# EAGLE design IQInput (EAGLE 9.3.1)

## Sheet 1 of 2
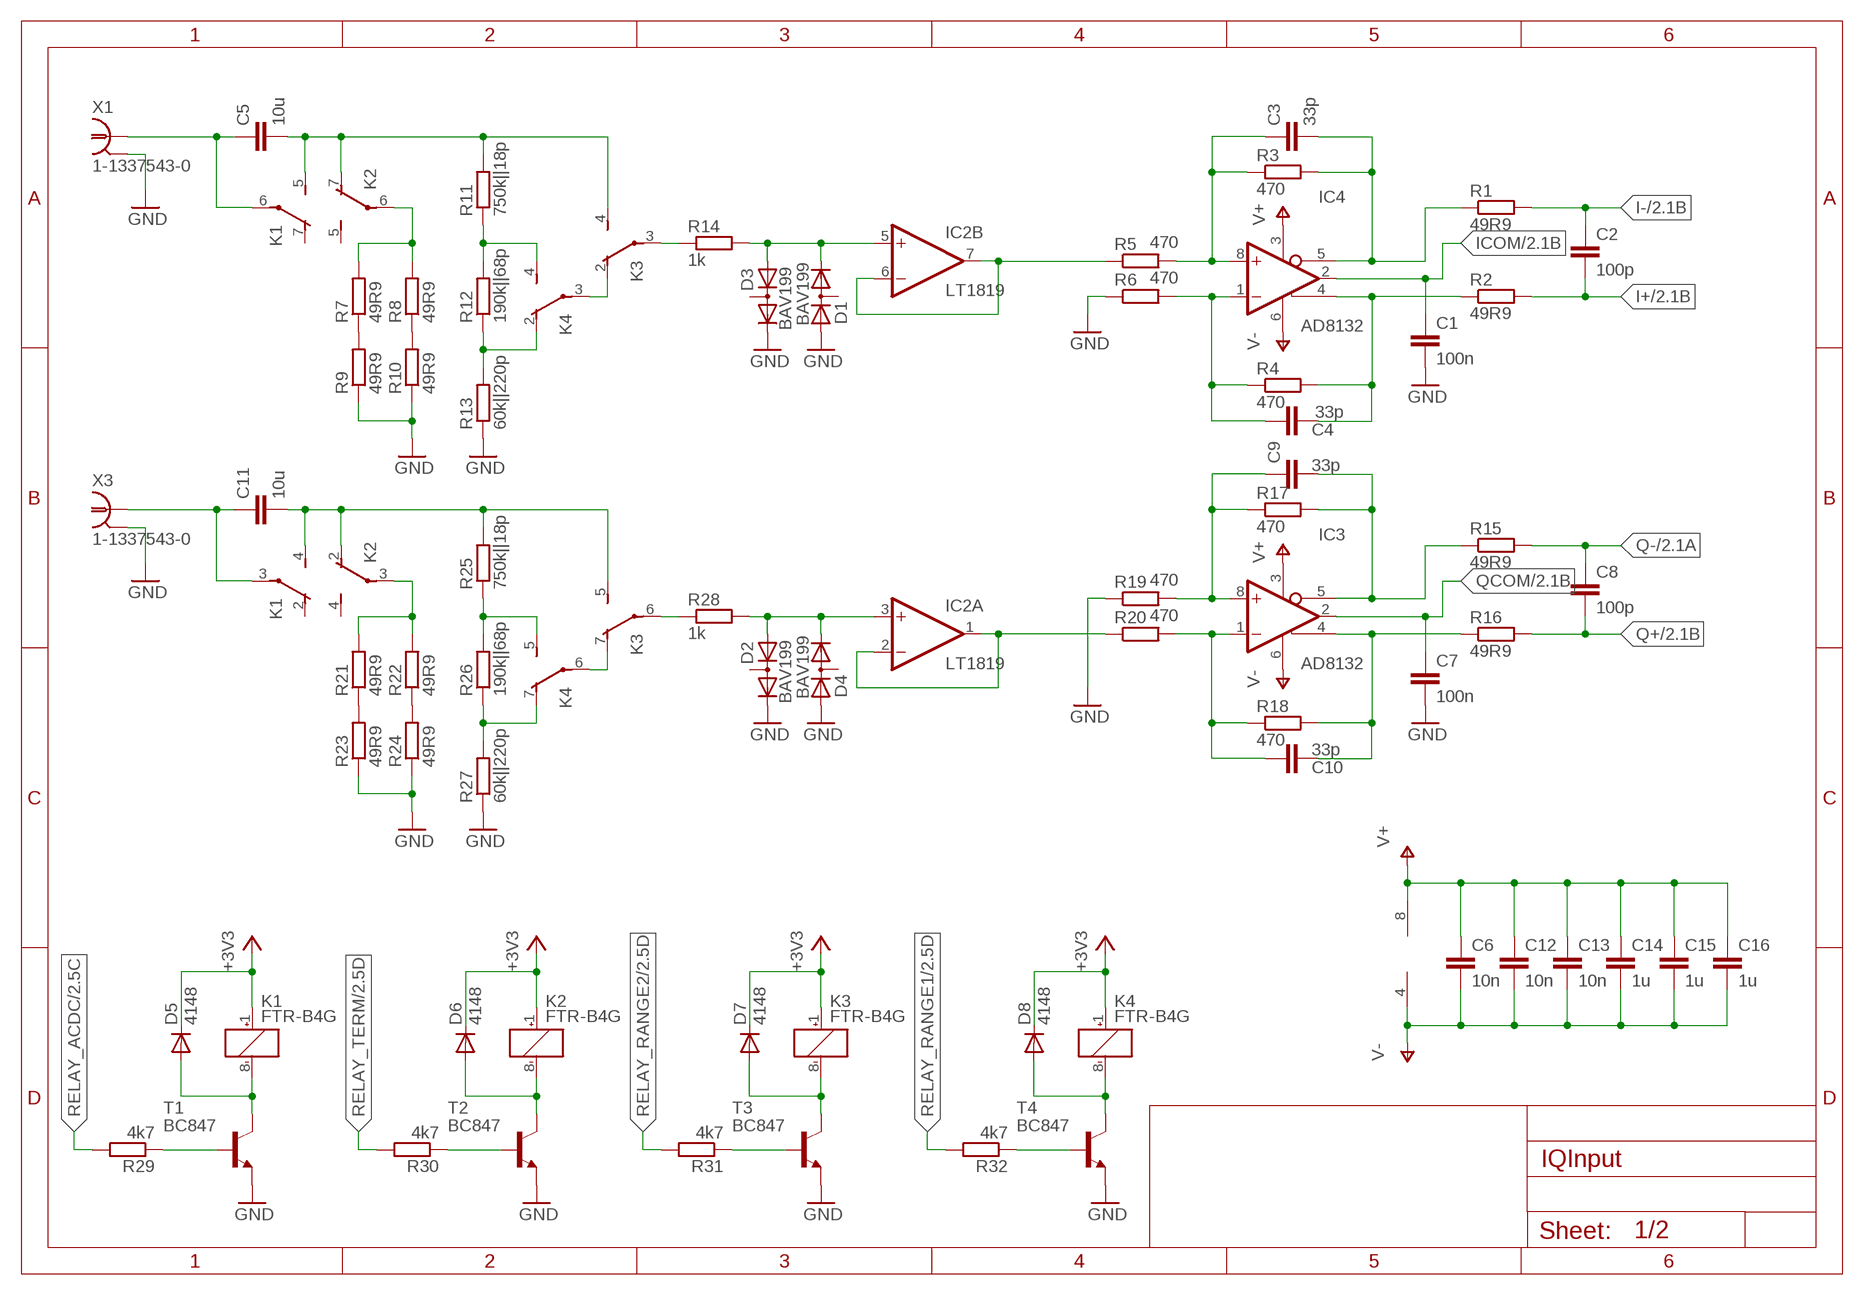
[diagram p0: schematic, sheet 1]

### Parts
C1  100n  C-EUC0603  [C0603]
C2  100p  C-EUC0603  [C0603]
C3  33p  C-EUC0603  [C0603]
C4  33p  C-EUC0603  [C0603]
C5  10u  C-EUC1206  [C1206]
C6  10n  C-EUC0603  [C0603]
C7  100n  C-EUC0603  [C0603]
C8  100p  C-EUC0603  [C0603]
C9  33p  C-EUC0603  [C0603]
C10  33p  C-EUC0603  [C0603]
C11  10u  C-EUC1206  [C1206]
C12  10n  C-EUC0603  [C0603]
C13  10n  C-EUC0603  [C0603]
C14  1u  C-EUC0603  [C0603]
C15  1u  C-EUC0603  [C0603]
C16  1u  C-EUC0603  [C0603]
D1  BAV199  [SOT23]
D2  BAV199  [SOT23]
D3  BAV199  [SOT23]
D4  BAV199  [SOT23]
D5  4148  DIODE-MINIMELF  [MINIMELF]
D6  4148  DIODE-MINIMELF  [MINIMELF]
D7  4148  DIODE-MINIMELF  [MINIMELF]
D8  4148  DIODE-MINIMELF  [MINIMELF]
IC2  LT1819  LM358D  [SO08]
IC3  AD8132  [MSOP8]
IC4  AD8132  [MSOP8]
K1  FTR-B4G  [FTR-B4G]
K2  FTR-B4G  [FTR-B4G]
K3  FTR-B4G  [FTR-B4G]
K4  FTR-B4G  [FTR-B4G]
R1  49R9  R-EU_R0603  [R0603]
R2  49R9  R-EU_R0603  [R0603]
R3  470  R-EU_R0603  [R0603]
R4  470  R-EU_R0603  [R0603]
R5  470  R-EU_R0603  [R0603]
R6  470  R-EU_R0603  [R0603]
R7  49R9  R-EU_R1206  [R1206]
R8  49R9  R-EU_R1206  [R1206]
R9  49R9  R-EU_R1206  [R1206]
R10  49R9  R-EU_R1206  [R1206]
R11  750k||18p  R-EU_R0603  [R0603]
R12  190k||68p  R-EU_R0603  [R0603]
R13  60k||220p  R-EU_R0603  [R0603]
R14  1k  R-EU_R0603  [R0603]
R15  49R9  R-EU_R0603  [R0603]
R16  49R9  R-EU_R0603  [R0603]
R17  470  R-EU_R0603  [R0603]
R18  470  R-EU_R0603  [R0603]
R19  470  R-EU_R0603  [R0603]
R20  470  R-EU_R0603  [R0603]
R21  49R9  R-EU_R1206  [R1206]
R22  49R9  R-EU_R1206  [R1206]
R23  49R9  R-EU_R1206  [R1206]
R24  49R9  R-EU_R1206  [R1206]
R25  750k||18p  R-EU_R0603  [R0603]
R26  190k||68p  R-EU_R0603  [R0603]
R27  60k||220p  R-EU_R0603  [R0603]
R28  1k  R-EU_R0603  [R0603]
R29  4k7  R-EU_R0603  [R0603]
R30  4k7  R-EU_R0603  [R0603]
R31  4k7  R-EU_R0603  [R0603]
R32  4k7  R-EU_R0603  [R0603]
T1  BC847  [SOT23]
T2  BC847  [SOT23]
T3  BC847  [SOT23]
T4  BC847  [SOT23]
X1  1-1337543-0  1-227161-7  [AMP_227161]
X3  1-1337543-0  1-227161-7  [AMP_227161]

### Nets
+3V3: D5.C D6.C D7.C D8.C K1.1(K:+) K2.1(K:+) K3.1(K:+) K4.1(K:+) ; also sheet 2
GND: C1.2 C7.2 D1.1(A) D2.2(C) D3.2(C) D4.1(A) R6.1 R9.1 R10.1 R13.1 R19.1 R23.1 R24.1 R27.1 T1.2(E) T2.2(E) T3.2(E) T4.2(E) X1.2 X3.2 ; also sheet 2
I+: C2.2 R2.2 ; also sheet 2
I-: C2.1 R1.2 ; also sheet 2
ICOM: C1.1 IC4.2(VOCM) ; also sheet 2
N$2: C4.2 IC4.4(+OUT) R2.1 R4.2
N$3: C5.1 K1.6(-2:P) X1.1
N$4: C4.1 IC4.1(-IN) R4.1 R6.2
N$5: C3.1 IC4.8(+IN) R3.1 R5.2
N$6: C3.2 IC4.5(-OUT) R1.1 R3.2
N$7: C5.2 K1.5(-2:S) K2.7(-2:O) K3.4(-1:S) R11.2
N$8: R8.1 R10.2
N$9: R7.1 R9.2
N$10: K2.6(-2:P) R7.2 R8.2
N$11: K4.4(-1:S) R11.1 R12.2
N$12: K4.2(-1:O) R12.1 R13.2
N$13: K3.2(-1:O) K4.3(-1:P)
N$14: K3.3(-1:P) R14.1
N$15: D1.2(C) D3.1(A) IC2.5(B:+IN) R14.2
N$16: IC2.6(B:-IN) IC2.7(B:OUT) R5.1
N$18: C10.2 IC3.4(+OUT) R16.1 R18.2
N$19: C10.1 IC3.1(-IN) R18.1 R20.2
N$20: C9.1 IC3.8(+IN) R17.1 R19.2
N$21: C9.2 IC3.5(-OUT) R15.1 R17.2
N$22: C11.1 K1.3(-1:P) X3.1
N$23: C11.2 K1.4(-1:S) K2.2(-1:O) K3.5(-2:S) R25.2
N$24: R22.1 R24.2
N$25: R21.1 R23.2
N$26: K2.3(-1:P) R21.2 R22.2
N$27: K4.5(-2:S) R25.1 R26.2
N$28: K4.7(-2:O) R26.1 R27.2
N$29: K3.7(-2:O) K4.6(-2:P)
N$30: K3.6(-2:P) R28.1
N$31: D2.1(A) D4.2(C) IC2.3(A:+IN) R28.2
N$32: IC2.1(A:OUT) IC2.2(A:-IN) R20.1
N$33: D5.A K1.8(K:-) T1.3(C)
N$34: R29.1 T1.1(B)
N$35: D6.A K2.8(K:-) T2.3(C)
N$36: R30.1 T2.1(B)
N$37: D7.A K3.8(K:-) T3.3(C)
N$38: R31.1 T3.1(B)
N$39: D8.A K4.8(K:-) T4.3(C)
N$40: R32.1 T4.1(B)
Q+: C8.2 R16.2 ; also sheet 2
Q-: C8.1 R15.2 ; also sheet 2
QCOM: C7.1 IC3.2(VOCM) ; also sheet 2
RELAY_ACDC: R29.2 ; also sheet 2
RELAY_RANGE1: R32.2 ; also sheet 2
RELAY_RANGE2: R31.2 ; also sheet 2
RELAY_TERM: R30.2 ; also sheet 2
V+: C6.1 C12.1 C13.1 C14.1 C15.1 C16.1 IC2.8(P:V+) IC3.3(V+) IC4.3(V+) ; also sheet 2
V-: C6.2 C12.2 C13.2 C14.2 C15.2 C16.2 IC2.4(P:V-) IC3.6(V-) IC4.6(V-) ; also sheet 2
Unconnected: D1.3(AC) D2.3(AC) D3.3(AC) D4.3(AC) K1.2(-1:O) K1.7(-2:O) K2.4(-1:S) K2.5(-2:S)

## Sheet 2 of 2
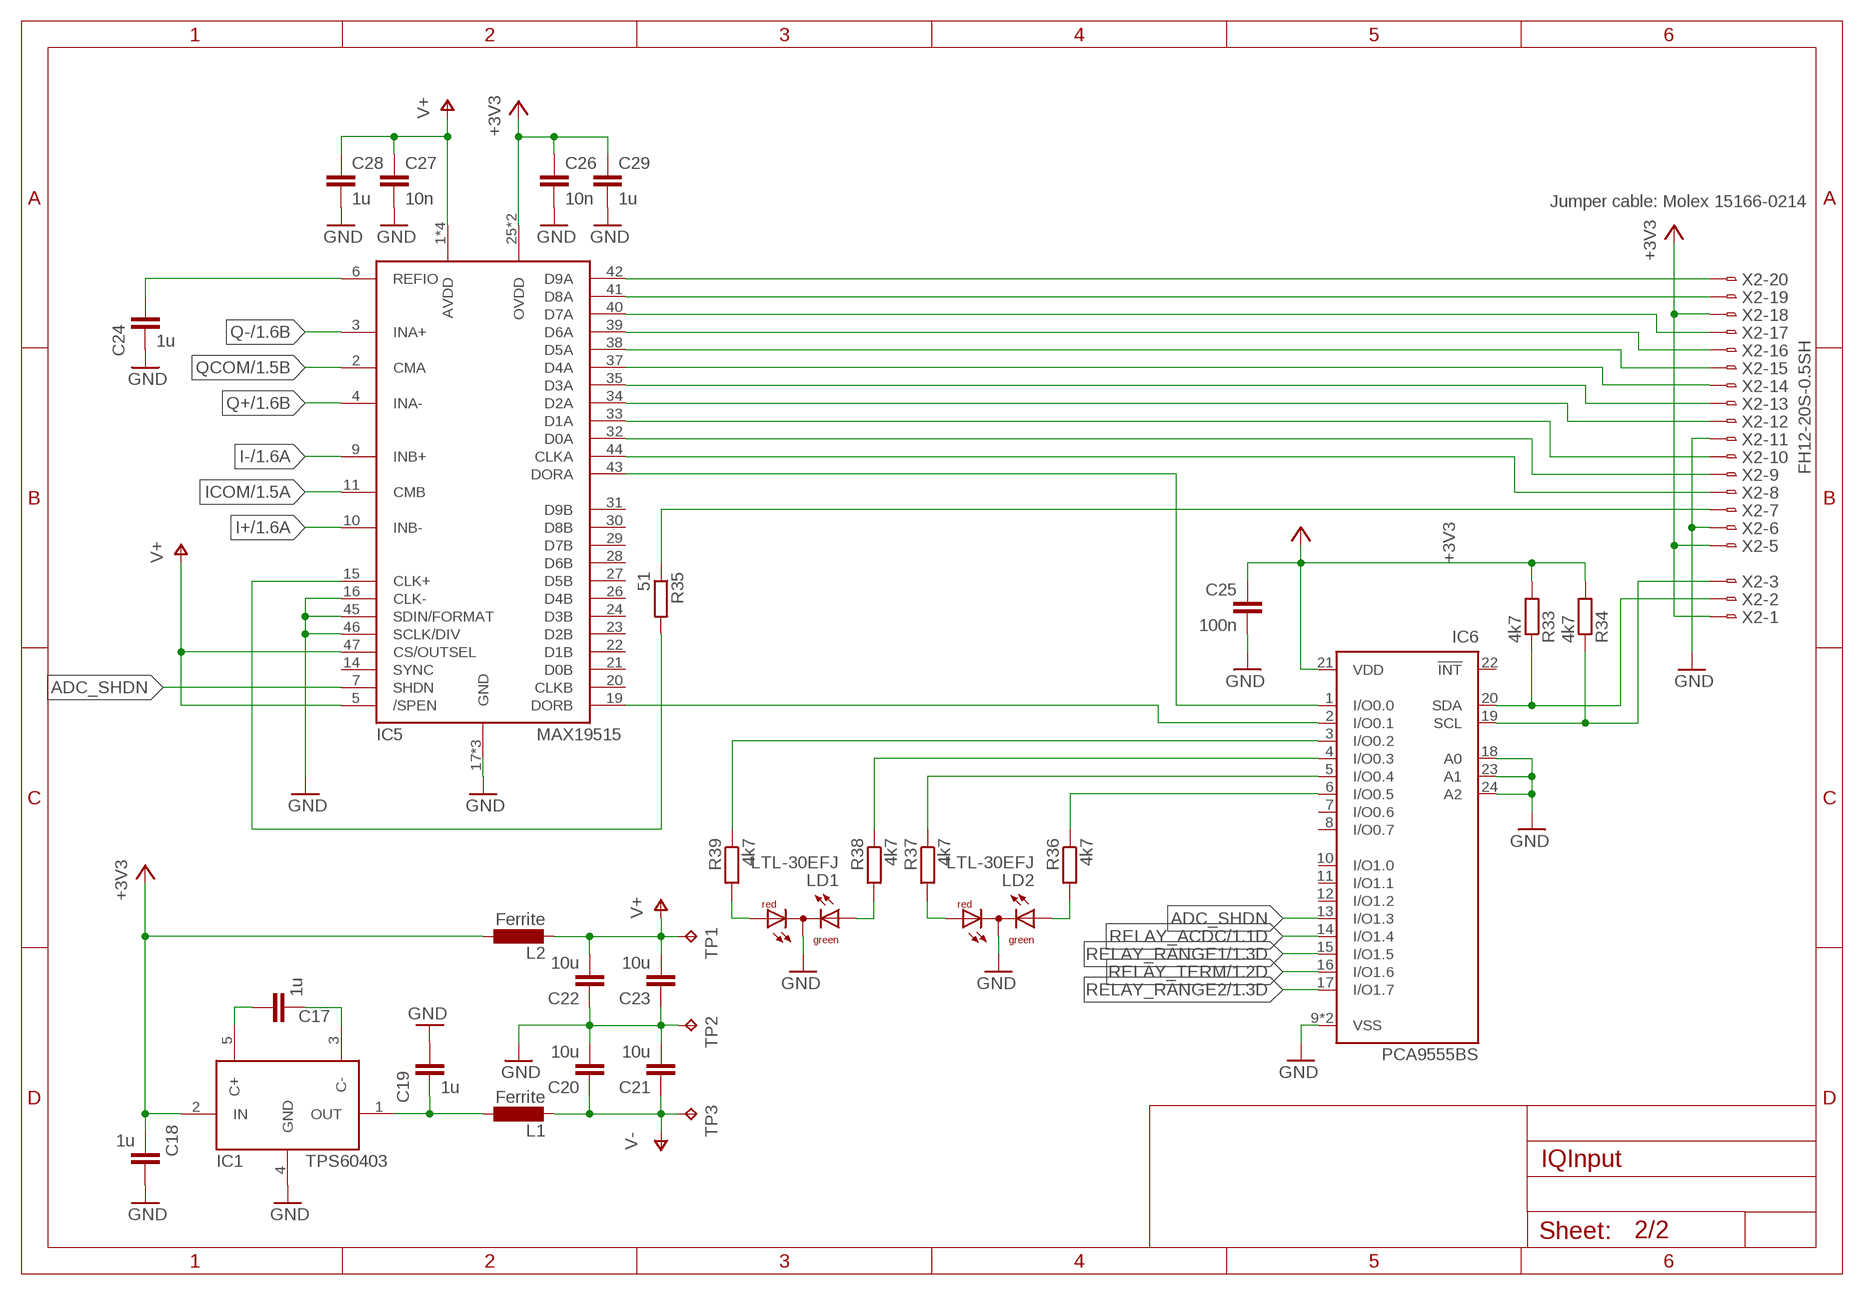
[diagram p1: schematic, sheet 2]

### Parts
C17  1u  C-EUC0603  [C0603]
C18  1u  C-EUC0603  [C0603]
C19  1u  C-EUC0603  [C0603]
C20  10u  C-EUC1206  [C1206]
C21  10u  C-EUC1206  [C1206]
C22  10u  C-EUC1206  [C1206]
C23  10u  C-EUC1206  [C1206]
C24  1u  C-EUC0603  [C0603]
C25  100n  C-EUC0603  [C0603]
C26  10n  C-EUC0603  [C0603]
C27  10n  C-EUC0603  [C0603]
C28  1u  C-EUC0603  [C0603]
C29  1u  C-EUC0603  [C0603]
IC1  TPS60403  [SOT23-5]
IC5  MAX19515  [QFN50P700X700X75-49T550N]
IC6  PCA9555BS  [HVQFN24]
L1  Ferrite  L-EUL2012C  [L2012C]
L2  Ferrite  L-EUL2012C  [L2012C]
LD1  LTL-30EFJ  DUOLED-RG-C  [DUOLED-C-5MM]
LD2  LTL-30EFJ  DUOLED-RG-C  [DUOLED-C-5MM]
R33  4k7  R-EU_R0603  [R0603]
R34  4k7  R-EU_R0603  [R0603]
R35  51  R-EU_R0603  [R0603]
R36  4k7  R-EU_R0603  [R0603]
R37  4k7  R-EU_R0603  [R0603]
R38  4k7  R-EU_R0603  [R0603]
R39  4k7  R-EU_R0603  [R0603]
TP1  TPTP15R  [TP15R]
TP2  TPTP15R  [TP15R]
TP3  TPTP15R  [TP15R]
X2  FH12-20S-0.5SH  [FH12-20S-0.5SH]

### Nets
+3V3: C18.2 C25.1 C26.1 C29.1 IC1.2(IN) IC5.25(OVDD) IC5.36(OVDD) IC6.21(VDD) L2.1 R33.2 R34.2 X2.1 X2.5 X2.18 ; also sheet 1
ADC_SHDN: IC5.7(SHDN) IC6.13(I/O1.3)
GND: C18.1 C19.1 C20.2 C21.2 C22.1 C23.1 C24.2 C25.2 C26.2 C27.2 C28.2 C29.2 IC1.4(GND) IC5.16(CLK-) IC5.17(GND) IC5.18(GND) IC5.45(SDIN/FORMAT) IC5.46(SCLK/DIV) IC5.49(GND) IC6.9(VSS) IC6.18(A0) IC6.23(A1) IC6.24(A2) IC6.TH(VSS) LD1.C LD2.C TP2.TP X2.6 X2.11 ; also sheet 1
I+: IC5.10(INB-) ; also sheet 1
I-: IC5.9(INB+) ; also sheet 1
ICOM: IC5.11(CMB) ; also sheet 1
N$1: C17.1 IC1.5(C+)
N$17: C17.2 IC1.3(C-)
N$41: C19.2 IC1.1(OUT) L1.1
N$42: C24.1 IC5.6(REFIO)
N$43: IC5.43(DORA) IC6.1(I/O0.0)
N$44: IC6.19(SCL) R34.1 X2.3
N$45: IC5.42(D9A) X2.20
N$46: IC5.41(D8A) X2.19
N$47: IC5.40(D7A) X2.17
N$48: IC5.39(D6A) X2.16
N$49: IC5.38(D5A) X2.15
N$50: IC5.37(D4A) X2.14
N$51: IC5.35(D3A) X2.13
N$52: IC5.34(D2A) X2.12
N$53: IC5.33(D1A) X2.10
N$54: IC5.32(D0A) X2.9
N$55: IC5.44(CLKA) X2.8
N$56: R35.1 X2.7
N$57: IC5.15(CLK+) R35.2
N$58: IC6.20(SDA) R33.1 X2.2
N$59: IC5.19(DORB) IC6.2(I/O0.1)
N$60: LD1.AR R39.2
N$61: LD1.AX(AG) R38.2
N$62: LD2.AR R37.2
N$63: LD2.AX(AG) R36.2
N$64: IC6.3(I/O0.2) R39.1
N$65: IC6.4(I/O0.3) R38.1
N$66: IC6.5(I/O0.4) R37.1
N$67: IC6.6(I/O0.5) R36.1
Q+: IC5.4(INA-) ; also sheet 1
Q-: IC5.3(INA+) ; also sheet 1
QCOM: IC5.2(CMA) ; also sheet 1
RELAY_ACDC: IC6.14(I/O1.4) ; also sheet 1
RELAY_RANGE1: IC6.15(I/O1.5) ; also sheet 1
RELAY_RANGE2: IC6.17(I/O1.7) ; also sheet 1
RELAY_TERM: IC6.16(I/O1.6) ; also sheet 1
V+: C22.2 C23.2 C27.1 C28.1 IC5.1(AVDD) IC5.5(/SPEN) IC5.12(AVDD) IC5.13(AVDD) IC5.47(CS/OUTSEL) IC5.48(AVDD) L2.2 TP1.TP ; also sheet 1
V-: C20.1 C21.1 L1.2 TP3.TP ; also sheet 1
Unconnected: IC5.14(SYNC) IC5.20(CLKB) IC5.21(D0B) IC5.22(D1B) IC5.23(D2B) IC5.24(D3B) IC5.26(D4B) IC5.27(D5B) IC5.28(D6B) IC5.29(D7B) IC5.30(D8B) IC5.31(D9B) IC6.7(I/O0.6) IC6.8(I/O0.7) IC6.10(I/O1.0) IC6.11(I/O1.1) IC6.12(I/O1.2) IC6.22(!INT) X2.4

### Notes on the sheet
- Jumper cable: Molex 15166-0214

## Library data of the parts
C1-C29 = rcl:C-EU: CAPACITOR, European symbol
D1-D4 = diode:BAV199: DIODE low-leakage double diode
D5-D8 = diode:DIODE-: DIODE
IC1 = rf:TPS60403
IC2 = linear:LM358: OP AMP also LM158; LM258; LM2904 Source: http://cache.national.com/ds/LM/LM158.pdf
IC3 IC4 = rf:AD8132
IC5 = rf:MAX19515
IC6 = micro-philips:PCA9555: 16-bit I2C and SMBus I/O port with interrupt Source: PCA9555_5.pdf; MPN: PCA9555BS,118; OC_FARNELL: 1575354; OC_NEWARK: 70R6671
K1-K4 = relay:FTR-B4: ULTRA MINIATURE RELAY 2 POLES - 2 A (Slim Profile Signal Relay) FUJITSU FTR-B4 SERIES Source: FTR-B4.pdf
L1 L2 = rcl:L-EU: INDUCTOR, European symbol
LD1 LD2 = led:DUOLED-RG-C: DUO LED 2 colors (red/green), 5 mm, round, common Cathode www.ligitek.com or other producers.
R1-R6 R11-R20 R25-R39 = rcl:R-EU_: RESISTOR, European symbol
R7-R10 R21-R24 = resistor:R-EU_: RESISTOR, European symbol
T1-T4 = transistor-neu-to92:BC847: NPN TRANSISTOR
TP1-TP3 = testpad:TP: Test pad
X1 X3 = con-coax:?227161*: JACK, RIGHT ANGLE, 50 OHM, PCB, BNC Source: amp_227161.pdf; MF: TYCO ELECTRONICS; MPN: 1-227161-7; OC_FARNELL: unknown; OC_NEWARK: 09H7855
X2 = con-hirose:FH12-20S-0.5S: 0.5mm Pitch Connectors For FPC/FFC Source: Data sheet <http://www.hirose.co.jp/cataloge_hp/e58605370.pdf>; MPN: FH12-20S-0.5SH(55); OC_FARNELL: 1324549; OC_NEWARK: 34M6166

## Board
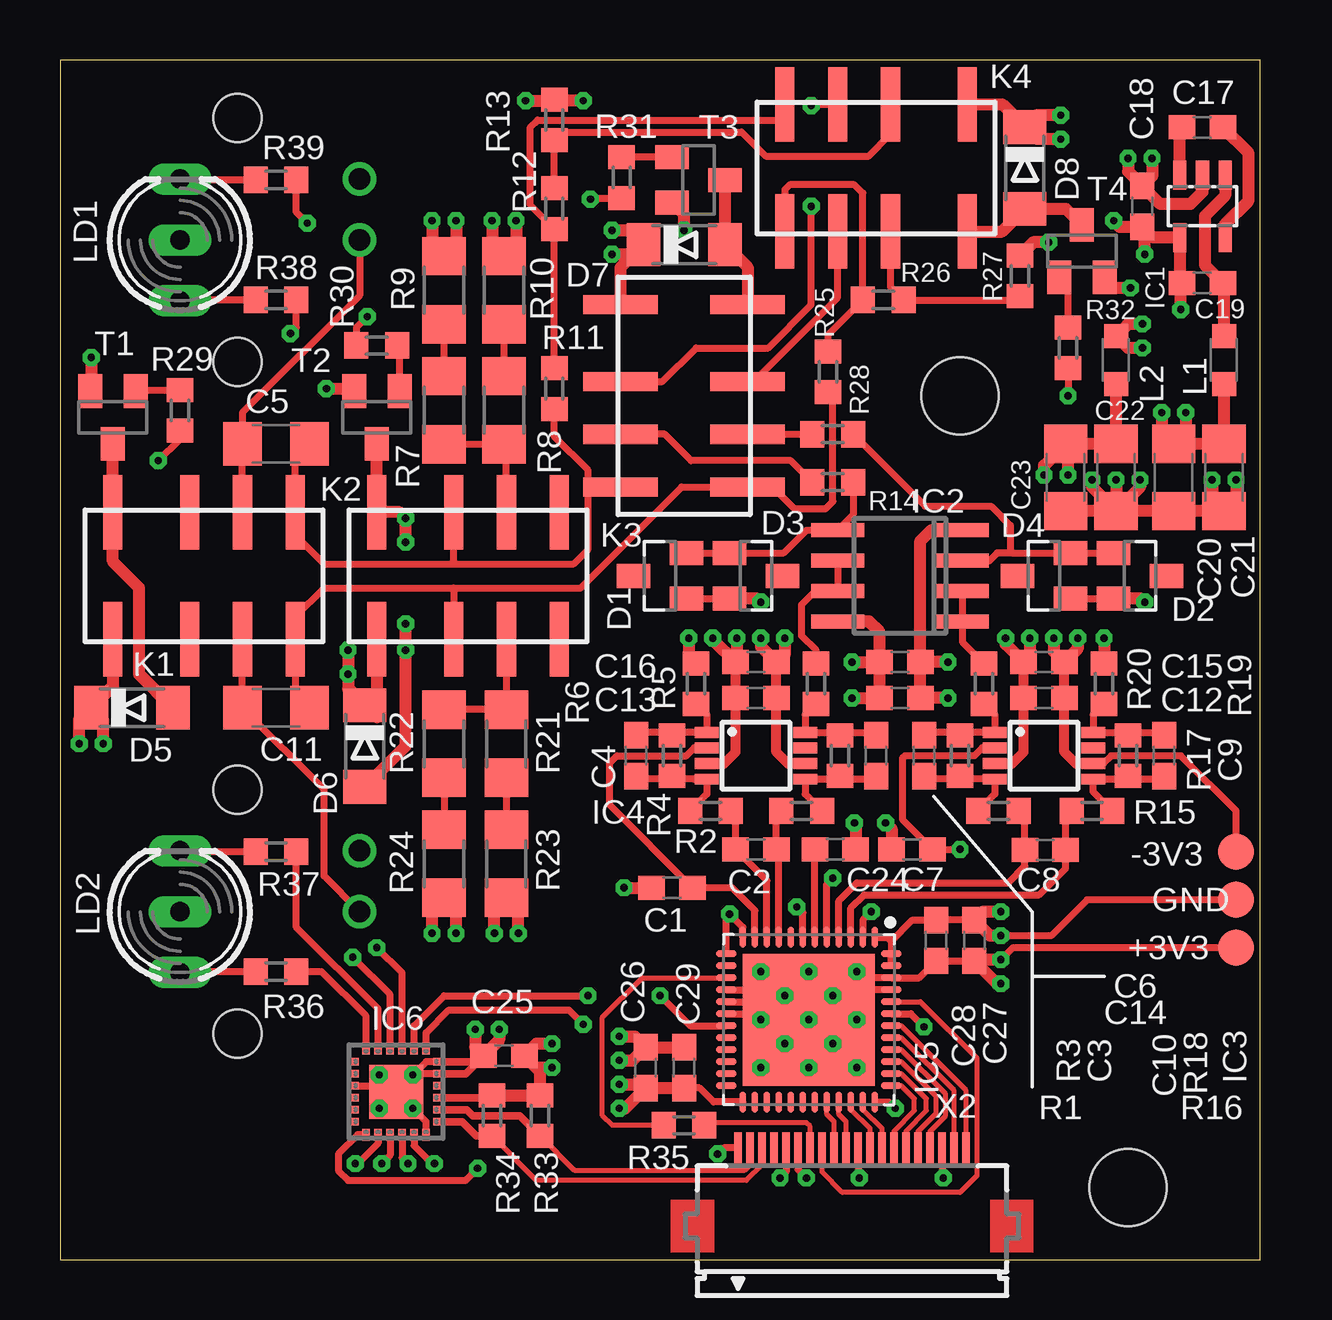
[diagram p2: board, top side]
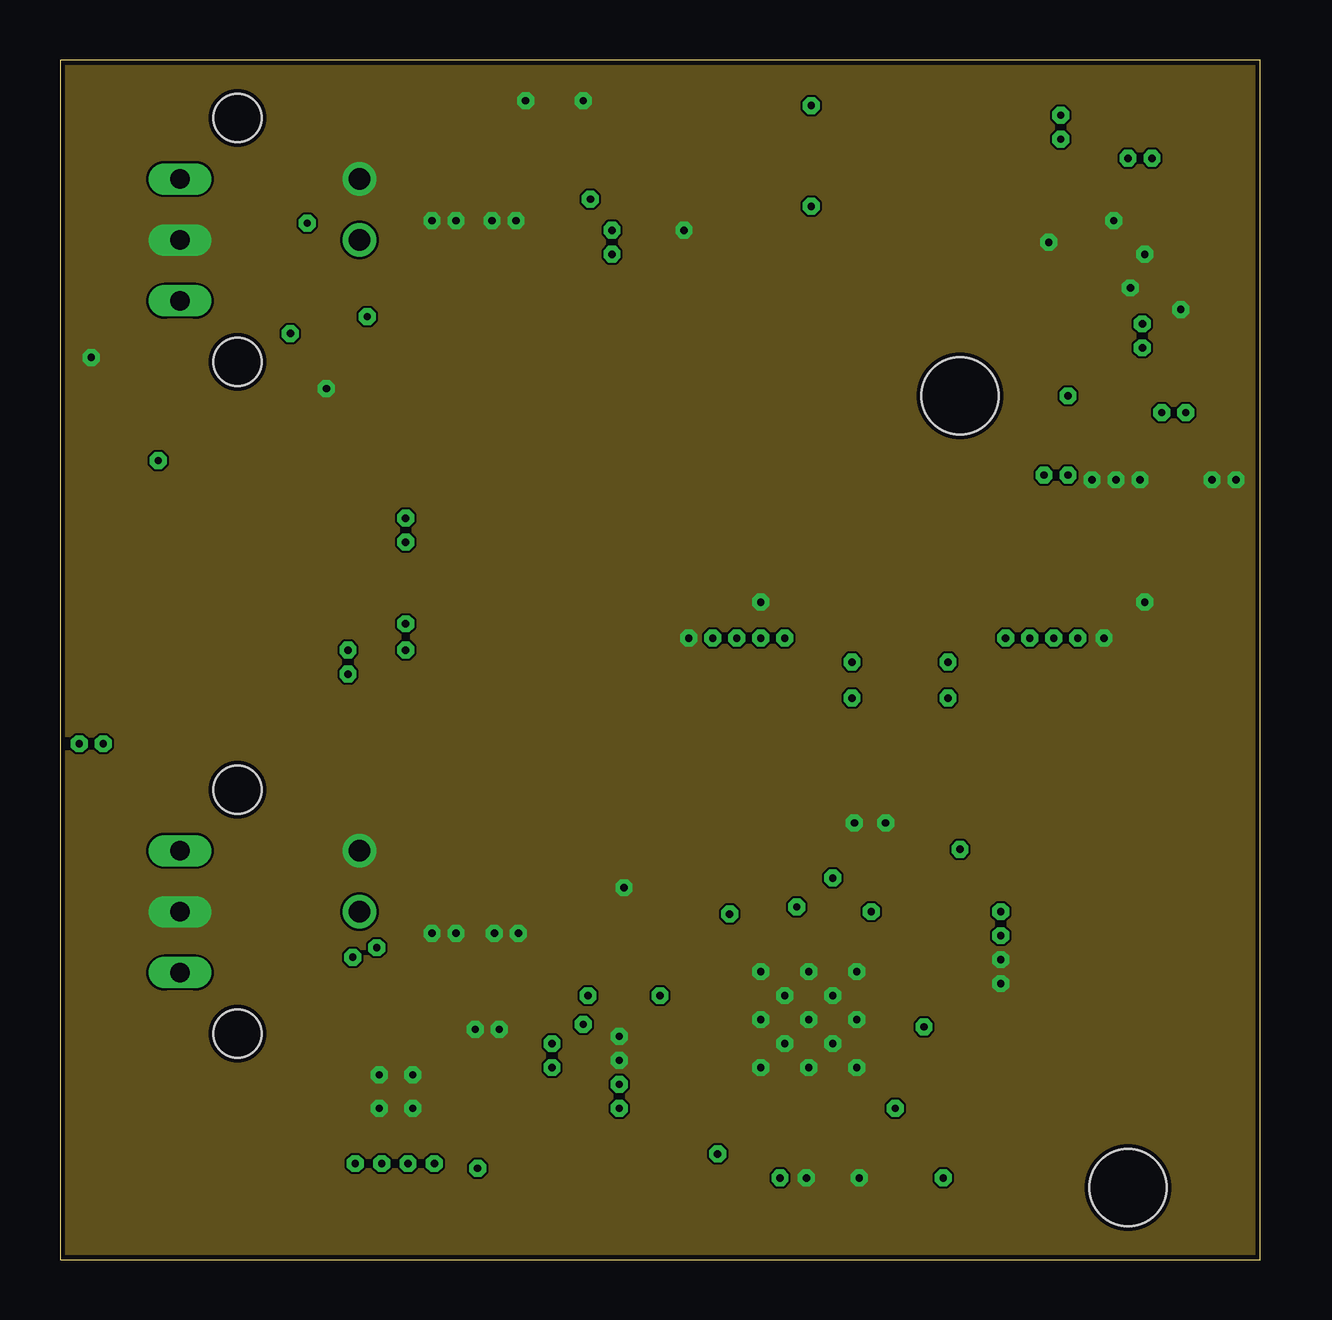
[diagram p3: board, inner layer Route2]
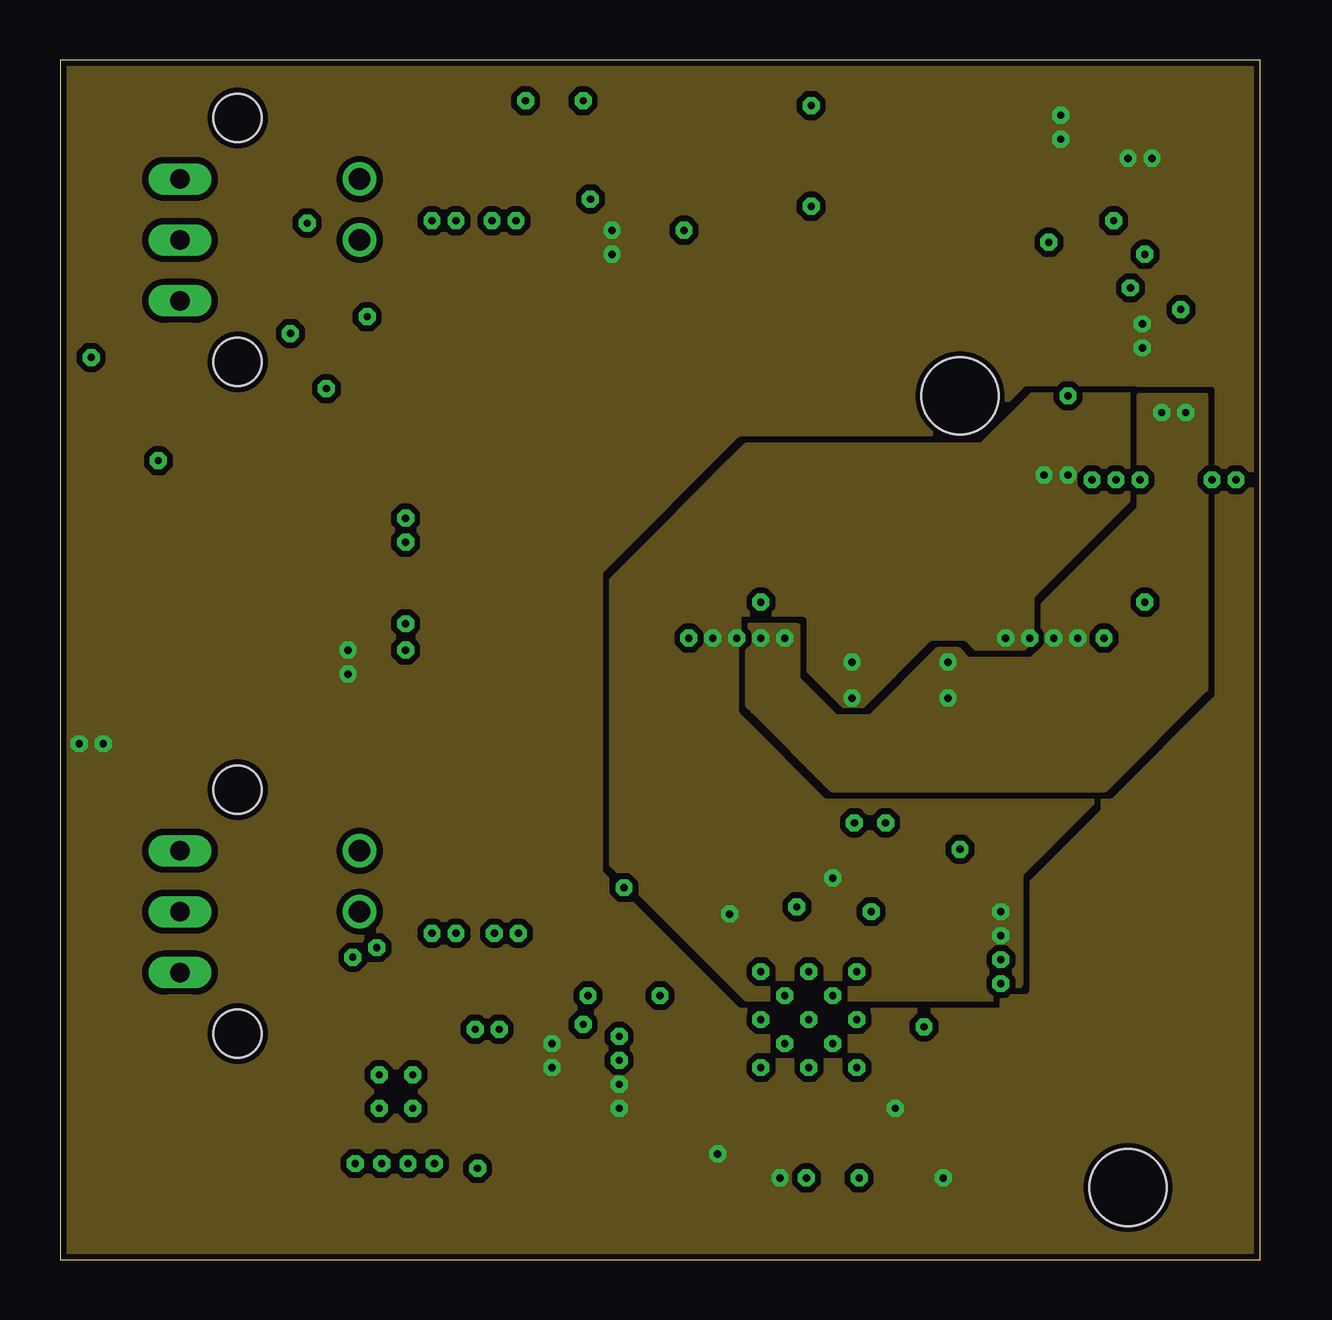
[diagram p4: board, inner layer Route15]
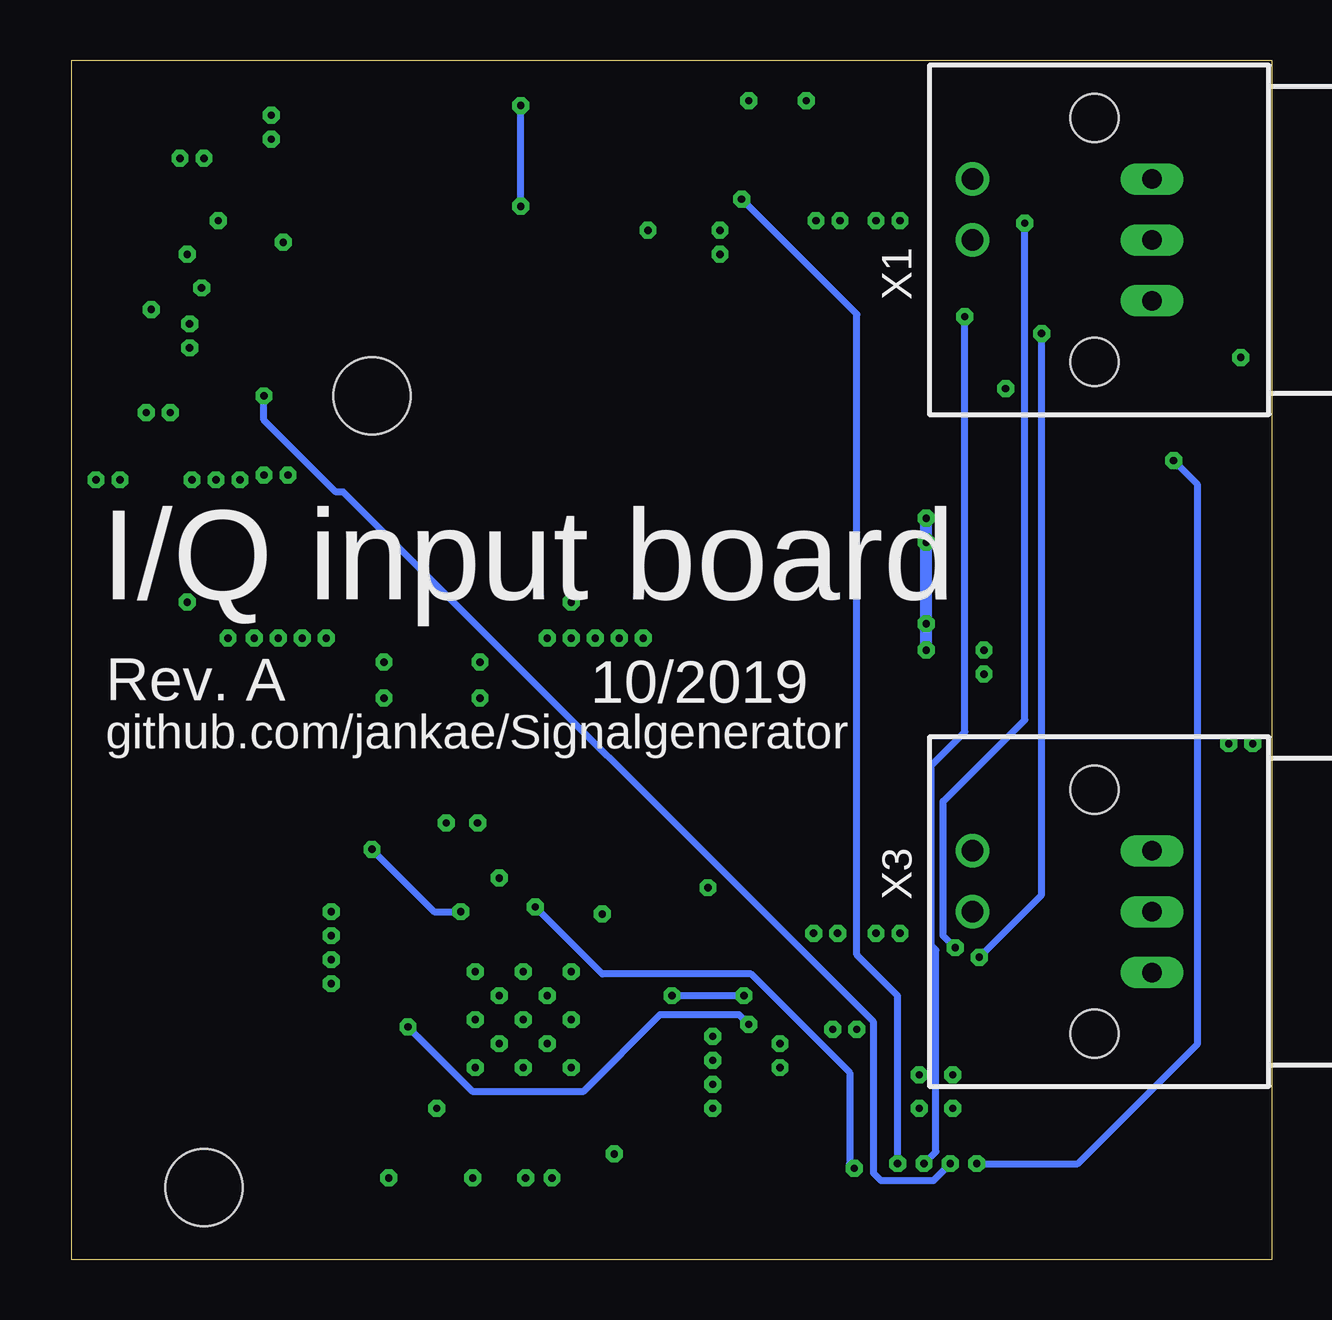
[diagram p5: board, bottom side, seen from below]

Size 50 x 50 mm. Coordinates in mm from the lower left corner, seen from the top.
Outline: 0,0 50,0 50,50 0,50 0,0
Copper layers (1+2*15+16): Top 0.035mm / dielectric 0.2mm / Route2 0.0175mm / dielectric 1.064mm / Route15 0.0175mm / dielectric 0.2mm / Bottom 0.035mm
Design rules "JLCPCB4L_7628": minimum track width 6mil, minimum drill 0.3mm, track to track 3.5mil, track to pad 3.5mil, pad to pad 3.5mil, via to via 3.5mil, smd to smd 0mil, copper to edge 0.2mm, drill to drill 0.2mm, minimum pad ring 10mil, minimum via ring 8mil, stop-mask expansion 4mil, vias tented up to drill 0mil, thermal gap 10mil
Holes 3.2 mm at 44.5,3 37.5,36
tKeepout: area 34,32.5 to 41,39.5; area 41,-0.5 to 48,6.5
bKeepout: area 41,-0.5 to 48,6.5; area 34,32.5 to 41,39.5

### Footprints (pad centres in the part's own frame; a part is rotated, then mirrored left to right if it is on the bottom)
C0603 = smd 1.1 x 1: 1 -0.85,0; 2 0.85,0
C1206 = smd 1.6 x 1.8: 1 -1.4,0; 2 1.4,0
SOT23 = smd 1 x 1.4: 1 -0.95,-1.1; 2 0.95,-1.1; 3 0,1.1
MINIMELF = smd 1.4 x 1.8: A 1.7,0; C -1.7,0
SOT23-5 = smd 0.55 x 1.2: 1 -0.95,-1.3; 2 0,-1.3; 3 0.95,-1.3; 4 0.95,1.3; 5 -0.95,1.3
SO08 = smd 0.6 x 2.2: 1 -1.905,-2.6; 2 -0.635,-2.6; 3 0.635,-2.6; 4 1.905,-2.6; 5 1.905,2.6; 6 0.635,2.6; 7 -0.635,2.6; 8 -1.905,2.6
MSOP8 = smd 0.45 x 1: 1 -0.975,-2.05; 2 -0.325,-2.05; 3 0.325,-2.05; 4 0.975,-2.05; 5 0.975,2.05; 6 0.325,2.05; 7 -0.325,2.05; 8 -0.975,2.05
QFN50P700X700X75-49T550N = smd 0.86 x 0.27: 1 -3.435,2.75; 2 -3.435,2.25; 3 -3.435,1.75; 4 -3.435,1.25; 5 -3.435,0.75; 6 -3.435,0.25; 7 -3.435,-0.25; 8 -3.435,-0.75; 9 -3.435,-1.25; 10 -3.435,-1.75; 11 -3.435,-2.25; 12 -3.435,-2.75; 25 3.435,-2.75; 26 3.435,-2.25; 27 3.435,-1.75; 28 3.435,-1.25; 29 3.435,-0.75; 30 3.435,-0.25; 31 3.435,0.25; 32 3.435,0.75; 33 3.435,1.25; 34 3.435,1.75; 35 3.435,2.25; 36 3.435,2.75 | smd 0.27 x 0.86: 13 -2.75,-3.435; 14 -2.25,-3.435; 15 -1.75,-3.435; 16 -1.25,-3.435; 17 -0.75,-3.435; 18 -0.25,-3.435; 19 0.25,-3.435; 20 0.75,-3.435; 21 1.25,-3.435; 22 1.75,-3.435; 23 2.25,-3.435; 24 2.75,-3.435; 37 2.75,3.435; 38 2.25,3.435; 39 1.75,3.435; 40 1.25,3.435; 41 0.75,3.435; 42 0.25,3.435; 43 -0.25,3.435; 44 -0.75,3.435; 45 -1.25,3.435; 46 -1.75,3.435; 47 -2.25,3.435; 48 -2.75,3.435 | smd 5.5 x 5.5: 49 0,0
HVQFN24 = smd 0.5 x 0.3: 1 -1.8,1.25; 2 -1.8,0.75; 3 -1.8,0.25; 4 -1.8,-0.25; 5 -1.8,-0.75; 6 -1.8,-1.25; 13 1.8,-1.25; 14 1.8,-0.75; 15 1.8,-0.25; 16 1.8,0.25; 17 1.8,0.75; 18 1.8,1.25 | smd 0.3 x 0.5: 7 -1.25,-1.8; 8 -0.75,-1.8; 9 -0.25,-1.8; 10 0.25,-1.8; 11 0.75,-1.8; 12 1.25,-1.8; 19 1.25,1.8; 20 0.75,1.8; 21 0.25,1.8; 22 -0.25,1.8; 23 -0.75,1.8; 24 -1.25,1.8 | smd 2.25 x 2.25: TH 0,0
FTR-B4G = smd 0.8 x 3.1: 1 -3.8,-2.65; 2 -0.6,-2.65; 3 1.6,-2.65; 4 3.8,-2.65; 5 3.8,2.65; 6 1.6,2.65; 7 -0.6,2.65; 8 -3.8,2.65
L2012C = smd 1 x 1: 1 -1,0; 2 1,0
DUOLED-C-5MM = drill 0.813 long: AR 2.54,0; AX -2.54,0; C 0,0
R0603 = smd 1 x 1.1: 1 -0.85,0; 2 0.85,0
R1206 = smd 1.6 x 1.803: 1 -1.422,0; 2 1.422,0
TP15R = smd 1.5 x 1.5: TP 0,0
AMP_227161 = drill 0.9 pad 1.27: 1 0,-5.08; 2 -2.54,-5.08 | hole 2: -5.08,0; 5.08,0
FH12-20S-0.5SH = smd 0.3 x 1.3: 1 -4.75,3.25; 2 -4.25,3.25; 3 -3.75,3.25; 4 -3.25,3.25; 5 -2.75,3.25; 6 -2.25,3.25; 7 -1.75,3.25; 8 -1.25,3.25; 9 -0.75,3.25; 10 -0.25,3.25; 11 0.25,3.25; 12 0.75,3.25; 13 1.25,3.25; 14 1.75,3.25; 15 2.25,3.25; 16 2.75,3.25; 17 3.25,3.25; 18 3.75,3.25; 19 4.25,3.25; 20 4.75,3.25

### Placement (x,y rotation side)
C1  25.5,15.5 180 top
C2  29,17.1 180 top
C3  34,21 270 top
C4  24,21 270 top
C5  9,34 0 top
C6  35,24.9 0 top
C7  35.5,17.1 180 top
C8  41.05,17.08 180 top
C9  46,21 270 top
C10  36,21 270 top
C11  9,23 0 top
C12  41,23.4 0 top
C13  29,23.4 0 top
C14  35,23.4 0 top
C15  41,24.9 0 top
C16  29,24.9 0 top
C17  47.6,47.2 180 top
C18  45.1,43.9 90 top
C19  47.6,40.7 0 top
C20  46.4,32.6 270 top
C21  48.5,32.6 270 top
C22  44,32.6 90 top
C23  41.9,32.6 90 top
C24  32.3,17.1 0 top
C25  18.5,8.5 180 top
C26  24.4,8 90 top
C27  38.1,13.3 270 top
C28  36.5,13.3 270 top
C29  26,8 90 top
D1  25,28.5 90 top
D2  45,28.5 270 top
D3  29,28.5 270 top
D4  41,28.5 90 top
D5  3,23 0 top
D6  12.7,21.4 270 top
D7  26.01,42.3 0 top
D8  40.2,45.5 270 top
IC1  47.6,43.9 180 top
IC2  35,28.5 90 top
IC3  41,21 270 top
IC4  29,21 270 top
IC5  31.2,10 270 top
IC6  14,7 270 top
K1  6,28.5 0 top
K2  17,28.5 0 top
K3  26,36 270 top
K4  34,45.5 180 top
L1  48.5,37.5 270 top
L2  44,37.5 270 top
LD1  5,42.5 90 top
LD2  5,14.5 90 top
R1  30.9,18.7 180 top
R2  27.1,18.7 0 top
R3  32.5,21 270 top
R4  25.5,21 270 top
R5  31.5,24 270 top
R6  26.5,24 270 top
R7  16,35.4 270 top
R8  18.5,35.4 270 top
R9  16,40.4 270 top
R10  18.5,40.4 270 top
R11  20.6,36.3 270 top
R12  20.6,43.8 270 top
R13  20.6,47.5 270 top
R14  32.2,32.4 0 top
R15  43,18.7 180 top
R16  39.1,18.7 0 top
R17  44.5,21 270 top
R18  37.5,21 270 top
R19  43.5,24 270 top
R20  38.5,24 270 top
R21  18.6,21.5 90 top
R22  16,21.5 90 top
R23  18.6,16.5 90 top
R24  16,16.5 90 top
R25  32,37 270 top
R26  34.3,40 180 top
R27  40,41 270 top
R28  32.2,34.4 0 top
R29  5,35.4 270 top
R30  13.2,38.1 180 top
R31  23.4,45.1 270 top
R32  42,38 270 top
R33  20,6 90 top
R34  18,6 90 top
R35  26,5.6 180 top
R36  9,12 180 top
R37  9,17 180 top
R38  9,40 180 top
R39  9,45 180 top
T1  2.2,35.1 180 top
T2  13.2,35.1 180 top
T3  26.6,45 270 top
T4  42.58,42.03 0 top
TP1  49,15 0 top
TP2  49,13 0 top
TP3  49,17 0 top
X1  7.4,42.5 270 bottom
X2  33,1.4 0 top
X3  7.4,14.5 270 bottom

### Tracks (layer width: path | path; a pad name or v marks a point on that pad's centre or on a via)
+3V3  (via drill 0.3)
  Top 0.3: IC5.36 34.53,6.57 v34.8,6.3 | X2.18 36.75,3.45 v36.8,3.4 | X2.5 30.25,3.65 v30,3.4 | X2.1 27.65,4.65 v27.4,4.4 | IC5.25 27.23,6.57 26.65,7.15 C29.1
  Top 0.305: IC6.21 17.9,6.75 R34.2
  Top 0.5: K2.1 13.2,23.6 | 13.2,23.6 D6.C | K1.1 2.2,23.9 D5.C | D7.C 23.35,41.34 K3.1 | K4.1 39.25,48.15 D8.C | IC1.2 47.6,44.5 47.1,44 45.85,44 C18.2 | v1.8,21.5 1.8,22.5 D5.C | v0.8,21.5 0.8,22.5 D5.C | 13.2,22.6 D6.C | 13.2,23.6 D6.C | v23,41.9 23.91,41.9 D7.C | v23,42.9 23.71,42.9 D7.C | v41.7,47.7 40.7,47.7 D8.C | v41.7,46.7 40.7,46.7 D8.C | v45.5,45.9 45.5,45.15 C18.2 | v44.5,45.9 44.5,45.35 C18.2 | v45.1,39 44.5,39 L2.1 44.5,38 v45.1,38 | v23.3,7.3 24.25,7.3 C26.1 | v23.3,6.3 23.55,6.3 C26.1 | C26.1 C29.1 | v20.5,9 19.85,9 C25.1 19.85,8 | v20.5,8 19.85,8 | 19.85,8 20,7.85 R33.2 R34.2 | v12,25.4 v12,24.4 12,23.8 D6.C
  pour Route15 (isolate 0.254, rank 6, no thermals): 0,0 50,0 50,50 0,50
ADC_SHDN  (via drill 0.3)
  Top 0.3: IC5.7 30.95,14.45 v30.7,14.7 | IC6.13 12.4,5.2 11.6,4.4 11.6,3.7 12,3.3 16.9,3.3 v17.4,3.8
  Bottom 0.3: v30.7,14.7 27.9,11.9 21.7,11.9 17.6,7.8 17.6,4 v17.4,3.8
GND  (via drill 0.3)
  Top 0.3: D4.1 D2.2 | D1.1 D3.2 | 32.5,11.3 32.95,11.75 IC5.46 35.8,11.75 C28.2 C27.2 | 32.5,11.3 IC5.49 | IC5.16 29.95,11.25 IC5.49 | IC5.17 30.45,10.75 IC5.49 | IC5.18 30.95,10.25 IC5.49 | IC6.9 13.75,7.25 IC6.TH | IC6.23 14.75,7.75 IC6.TH | IC6.24 15.25,8.25 IC6.TH | IC6.18 15.25,5.75 IC6.TH | X2.11 33.25,3.45 v33.3,3.4 | X2.6 30.75,3.75 v31.1,3.4 | IC5.45 32.55,11.25 32.5,11.3 | TP2.TP 39.7,13 v39.2,12.5
  Top 0.305: IC6.23 16.9,7.75 C25.2 17.4,8.25 IC6.24
  Top 0.5: C18.1 45.55,42.6 IC1.4 46.65,40.8 C19.1 46.7,40.65 v46.7,39.6 | C21.2 C20.2 C22.1 | C22.1 C23.1 | v19,43.3 19,42.32 R10.1 18,42.32 v18,43.3 | v16.5,43.3 16.5,42.32 R9.1 15.5,42.32 v15.5,43.3 | v1.3,37.6 1.3,36.25 T1.2 | v11.1,36.3 12.15,36.3 T2.2 | v15.5,13.6 15.5,14.58 R24.1 16.5,14.58 v16.5,13.6 | v18.1,13.6 18.1,14.58 R23.1 19.1,14.58 v19.1,13.6 | v23.5,15.5 C1.2 | v18.3,9.6 18.3,9.15 C25.2 17.3,8.85 v17.3,9.6 | v23.3,8.3 23.85,8.3 C26.2 | v23.3,9.3 23.95,9.3 C26.2 | C26.2 C29.2 | v39.2,11.5 39.05,11.5 C27.2 38.15,12.5 v39.2,12.5 | v34.4,18.2 34.65,17.95 C7.2 | v33.1,18.2 33.15,18.15 C24.2 | v26.2,25.9 26.2,25.15 R6.1 | v29.2,27.4 29.05,27.55 D3.2 | v43.5,25.9 R19.1 | v45.2,27.4 45.05,27.55 D2.2 | v49,32.5 49,31.7 C21.2 | v48,32.5 48,31.7 C21.2 | v45,32.5 45,32.2 C22.1 | v44,32.5 C22.1 | v43,32.5 43,32.2 C22.1 | v44.6,40.5 43.96,40.5 T4.2 | v45.2,41.9 45.2,42.95 C18.1 | v43.9,43.3 44.15,43.05 C18.1 | v26,42.9 26,43.55 T3.2 | v19.4,48.3 20.55,48.3 | 20.55,48.3 R13.1 | v21.8,48.3 20.55,48.3 | v41.2,42.4 40.55,42.4 R27.1
  other vias: 31.2,10 33.2,10 33.2,12 31.2,12 29.2,12 29.2,10 29.2,8 31.2,8 33.2,8 32.2,9 30.2,9 30.2,11 32.2,11 14.7,6.3 14.7,7.7 13.3,7.7 13.3,6.3
  pour Route2 (no thermals): 0,50 50,50 50,0 0,0
I+
  Top 0.3: R2.2 28.15,18.5 C2.2 29.45,15.8 IC5.10
I-
  Top 0.3: C2.1 29.85,17.3 | 29.85,17.3 29.85,18.5 R1.2 | IC5.9 29.95,17.2 29.85,17.3
ICOM
  Top 0.3: IC5.11 28.95,14.55 28,15.5 C1.1 22.9,18.95 22.9,20.7 23.2,21 26.1,21 26.43,21.32 IC4.2
N$1
  Top 0.5: C17.1 49.5,46.15 49.5,44.1 48.55,43.15 IC1.5
N$2
  Top 0.3: 26.4,20.02 IC4.4 26.95,19.4 R2.1 | 26.4,20.02 25.62,20.02 R4.2 | 26.4,20.02 24.12,20.02 C4.2
N$3
  Top 0.3: K1.6 C5.1 7.6,35.3 12.48,40.18 X1.1
N$4
  Top 0.3: R6.2 26.95,22.7 IC4.1 26.3,21.98 | 26.3,21.98 25.62,21.98 R4.1 | 26.3,21.98 24.12,21.98 C4.1
N$5
  Top 0.3: R5.2 31.05,22.7 IC4.8 32.6,21.98 | 32.6,21.98 33.88,21.98 C3.1 | R3.1 32.5,21.88 32.6,21.98
N$6
  Top 0.3: 32.5,20.02 IC4.5 31.05,19.4 R1.1 | 32.5,20.02 33.88,20.02 C3.2 | R3.2 32.5,20.02
N$7
  Top 0.3: C5.2 9.8,33.4 K1.5 9.8,30.2 11,29 16.4,29 | 16.4,29 K2.7 | 16.4,29 21.4,29 22,29.6 22,32.2 | 22,32.2 22,32.9 20.6,34.3 R11.2 | K3.4 22,32.2
N$8
  Top 0.3: R8.1 R10.2
N$9
  Top 0.3: R7.1 R9.2
N$10
  Top 0.3: K2.6 18.6,33.88 R8.2 R7.2
N$11
  Top 0.3: R11.1 R12.2 19.6,43.95 19.6,47.2 19.9,47.5 30,47.5 30.2,47.3 K4.4
N$12
  Top 0.3: R12.1 R13.2 20.95,47 28.4,47 29.4,46 33.7,46 34.6,46.9 K4.2
N$13  (via drill 0.3)
  Top 0.3: K3.2 25.1,36.6 26.5,38 29.5,38 31.3,39.8 v31.3,43.9 | v31.3,48.1 31.35,48.15 K4.3
  Bottom 0.3: v31.3,43.9 v31.3,48.1
N$14
  Top 0.3: R14.1 30.45,33.3 26.3,33.3 25.2,34.4 K3.3
N$15
  Top 0.3: R14.2 33.05,31.05 IC2.5 31.11,30.41 30.15,29.45 D3.1 D1.2
N$16
  Top 0.3: IC2.6 IC2.7 31.46,27.86 30.9,27.3 30.9,26 31.5,25.4 R5.1
N$17
  Top 0.5: IC1.3 46.65,47.1 C17.2
N$18
  Top 0.3: 37.5,20.02 IC3.4 38.95,19.4 R16.1 | 37.5,20.02 36.12,20.02 C10.2 | R18.2 37.5,20.02
N$19
  Top 0.3: 37.4,21.98 IC3.1 38.95,22.7 R20.2 | 37.4,21.98 36.12,21.98 C10.1 | R18.1 37.4,21.95 37.4,21.98
N$20
  Top 0.3: 44.5,21.98 IC3.8 43.05,22.7 R19.2 | 44.5,21.98 45.88,21.98 C9.1 | R17.1 44.5,21.98
N$21
  Top 0.3: 44.6,20.02 IC3.5 43.05,19.5 R15.1 | 44.6,20.02 45.88,20.02 C9.2 | R17.2 44.6,20.05 44.6,20.02
N$22
  Top 0.3: X3.1 11,15.98 11,19.6 C11.1 K1.3
N$23
  Top 0.3: C11.2 9.8,23.6 K1.4 9.8,26.8 11,28 16.4,28 | 16.4,28 K2.2 | 16.4,28 21.7,28 25.9,32.2 K3.5 29.7,32.2 30.6,31.3 31.9,31.3 32.2,31.6 32.2,35.95 R25.2
N$24
  Top 0.3: R22.1 R24.2
N$25
  Top 0.3: R21.1 R23.2
N$26
  Top 0.3: K2.3 R21.2 R22.2
N$27
  Top 0.3: K4.5 30.2,44.6 30.4,44.8 33.1,44.8 33.45,44.45 R26.2 32,38.55 R25.1
N$28
  Top 0.3: K4.7 34.6,40.55 R26.1 39.85,40 R27.2
N$29
  Top 0.3: K4.6 32.4,40.1 28.9,36.6 K3.7
N$30
  Top 0.3: K3.6 R28.1
N$31
  Top 0.3: R28.2 36.05,31.4 38.8,31.4 39.6,30.6 39.6,29.5 39.65,29.45 | 39.65,29.45 41.8,29.45 | 41.8,29.45 D2.1 | D4.2 41.8,29.45 | 39.65,29.45 39.05,29.45 38.73,29.14 IC2.3
N$32
  Top 0.3: IC2.2 IC2.1 37.6,25.75 R20.1
N$33
  Top 0.5: D5.A 3.3,24.4 3.3,28 2.2,29.1 K1.8 T1.3
N$34
  Top 0.3: T1.1 3.2,36.25 R29.1
N$35  (via drill 0.3)
  Top 0.5: T2.3 K2.8 14.15,31.15 v14.4,30.9 v14.4,29.9 | D6.A 14.4,21.4 v14.4,25.4 v14.4,26.5
  Bottom 0.5: v14.4,25.4 v14.4,29.9 v14.4,30.9
N$36
  Top 0.3: T2.1 14.15,38 R30.1
N$37
  Top 0.5: K3.8 28.65,41.36 D7.A T3.3
N$38
  Top 0.3: T3.1 R31.1
N$39
  Top 0.5: K4.8 39.25,42.85 D8.A 41.91,43.8 T4.3
N$40
  Top 0.3: R32.1 42,40.56 T4.1
N$41
  Top 0.5: IC1.1 48.55,44.35 47.7,43.5 47.7,41.45 C19.2 48.5,40.65 L1.1
N$42
  Top 0.3: IC5.6 C24.1
N$43  (via drill 0.3)
  Top 0.3: IC5.43 35.45,10.25 v36,9.7 | IC6.1 15.25,9.45 16.2,10.4 21.2,10.4 v21.8,9.8
  Bottom 0.3: v21.8,9.8 22.2,10.2 25.5,10.2 28.7,7 33.3,7 v36,9.7
N$44
  Top 0.2: X2.3 29.25,3.95 28.6,3.3 19.85,3.3 R34.1
  Top 0.305: IC6.19 16.75,5.75 17.35,5.15 R34.1
N$45
  Top 0.2: X2.20 37.75,7.05 35.05,9.75 IC5.42
N$46
  Top 0.2: X2.19 37.25,7.05 35.05,9.25 IC5.41
N$47
  Top 0.2: X2.17 36.25,5.35 36.9,6 36.9,6.9 35.05,8.75 IC5.40
N$48
  Top 0.2: X2.16 35.75,5.35 36.5,6.1 36.5,6.8 35.05,8.25 IC5.39
N$49
  Top 0.2: X2.15 35.25,5.35 36.1,6.2 36.1,6.7 35.05,7.75 IC5.38
N$50
  Top 0.2: X2.14 34.75,5.35 35.6,6.2 35.6,6.7 35.05,7.25 IC5.37
N$51
  Top 0.2: X2.13 34.25,5.45 33.45,6.25 IC5.35
N$52
  Top 0.2: X2.12 33.75,5.45 32.95,6.25 IC5.34
N$53
  Top 0.2: X2.10 32.75,5.75 32.45,6.05 IC5.33
N$54
  Top 0.2: X2.9 32.25,5.75 31.95,6.05 IC5.32
N$55
  Top 0.2: IC5.44 35.85,10.75 38.2,8.4 38.2,3.5 37.5,2.8 32.6,2.8 31.75,3.65 X2.8
N$56
  Top 0.2: X2.7 31.25,5.55 31.1,5.7 26.95,5.7 R35.1
N$57
  Top 0.2: R35.2 23,5.6 22.6,6 22.6,10.1 24.25,11.75 IC5.15
N$58
  Top 0.2: X2.2 28.75,3.95 28.5,3.7 21.45,3.7 R33.1
  Top 0.305: IC6.20 16.95,6.25 17.2,6 19.15,6 R33.1
N$59  (via drill 0.3)
  Top 0.3: IC6.2 14.75,9.75 16,11 v22,11 | v25,11 26.25,9.75 IC5.19
  Bottom 0.3: v22,11 v25,11
N$60
  Top 0.3: R39.2 5.04,45 LD1.AR
N$61
  Top 0.3: R38.2 5.04,40 LD1.AX
N$62
  Top 0.3: R37.2 5.04,17 LD2.AR
N$63
  Top 0.3: R36.2 5.04,12 LD2.AX
N$64  (via drill 0.3)
  Top 0.3: IC6.3 14.25,11.95 v13.2,13 | v10.3,43.2 9.85,43.65 R39.1
  Bottom 0.3: v13.2,13 13.7,13.5 13.7,19.1 10.3,22.5 v10.3,43.2
N$65  (via drill 0.3)
  Top 0.3: IC6.4 13.75,11.05 v12.2,12.6 | v9.6,38.6 9.85,38.85 R38.1
  Bottom 0.3: v12.2,12.6 9.6,15.2 v9.6,38.6
N$66
  Top 0.3: IC6.5 13.25,10.45 9.85,13.85 R37.1
N$67
  Top 0.3: IC6.6 12.75,10.15 10.9,12 R36.1
Q+
  Top 0.3: R16.2 40.2,18.45 C8.2 40.2,16.4 39.5,15.7 33.2,15.7 32.45,14.95 IC5.4
Q-
  Top 0.3: R15.2 41.9,18.45 C8.1 41.9,16.3 40.8,15.2 33.5,15.2 32.95,14.65 IC5.3
QCOM  (via drill 0.3)
  Top 0.3: IC3.2 38.42,21.32 38.1,21 35.2,21 35.1,20.9 35.1,18.35 C7.1 v37.5,17.1 | v33.8,14.5 33.45,14.15 IC5.2
  Bottom 0.3: v37.5,17.1 34.9,14.5 v33.8,14.5
RELAY_ACDC  (via drill 0.3)
  Top 0.3: IC6.14 13.25,4.85 12.4,4 v12.3,4 | v4.1,33.3 5,34.2 R29.2
  Bottom 0.3: v12.3,4 8.1,4 3.1,9 3.1,32.3 v4.1,33.3
RELAY_RANGE1  (via drill 0.3)
  Top 0.3: IC6.15 13.75,4.35 v13.4,4 | R32.2 v42,36
  Bottom 0.3: v13.4,4 14.1,3.3 16.3,3.3 16.6,3.6 16.6,9.9 38.7,32 39,32 42,35 v42,36
RELAY_RANGE2  (via drill 0.3)
  Top 0.3: IC6.17 14.75,4.75 15.5,4 v15.6,4 | v22.1,44.2 22.15,44.25 R31.2
  Bottom 0.3: v15.6,4 15.6,11 17.3,12.7 17.3,39.4 v22.1,44.2
RELAY_TERM  (via drill 0.3)
  Top 0.3: IC6.16 14.25,4.25 v14.5,4 | v12.8,39.3 12.35,38.85 R30.2
  Bottom 0.3: v14.5,4 14,4.5 14,12.9 14.2,13.1 14.2,20.6 12.8,22 v12.8,39.3
V+  (via drill 0.3)
  Top 0.3: C27.1 36.7,14.15 | 36.7,14.15 C28.1 | IC5.47 IC5.48 34.63,13.27 | IC5.1 34.47,13.44 34.63,13.27 | 34.63,13.27 35.52,14.15 36.7,14.15 | IC5.5 31.95,15.65 v32.2,15.9 | IC5.12 28.45,13.85 v27.9,14.4 27.77,14.27 IC5.13 | TP1.TP 42.8,15 41.3,13.5 38.75,13.5
  Top 0.406: IC4.3 27.68,20.68 28.15,21.15 C13.1 C16.1 | IC3.3 39.67,20.68 40.15,21.15 C12.1 C15.1
  Top 0.5: C6.1 C14.1 v33,23.4 | C6.1 34.15,26.15 33.7,26.6 33.7,26.59 IC2.8 | C23.2 C22.2 L2.2 | v39.2,14.5 38.45,14.5 C27.1 38.75,13.5 v39.2,13.5 | v28.2,25.9 28.2,24.95 C16.1 27.2,25.85 v27.2,25.9 | v33,24.9 C6.1 | v39.4,25.9 39.4,25.65 C15.1 40.4,25.15 v40.4,25.9 | v42,32.7 42,33.9 C23.2 | v41,32.7 41,33.1 C23.2
  pour Route15 (isolate 0.254, rank 2): 47.7,36 40.5,36 38.4,33.9 28.6,33.9 23,28.3 23,16.5 28.6,10.9 39.4,10.9 40,11.5 40,16.1 47.7,23.8
V-  (via drill 0.3)
  Top 0.3: IC3.6 43.48,20.68 43.8,21 46.7,21 49,18.7 TP3.TP
  Top 0.406: IC4.6 30.32,20.68 29.85,21.15 C13.2 C16.2 | IC3.6 42.33,20.68 41.85,21.15 C12.2 C15.2
  Top 0.5: C6.2 C14.2 v37,23.4 | C6.2 35.85,29.95 36.3,30.41 IC2.4 | L1.2 C21.1 46.6,34 | 46.6,34 C20.1 45.9,34.5 v45.9,35.3 | v42.4,25.9 42.4,25.45 C15.2 41.4,25.35 v41.4,25.9 | v37,24.9 C6.2 | v30.2,25.9 30.2,25.25 C16.2 29.2,25.55 v29.2,25.9 | v46.9,35.3 46.9,34.3 46.6,34
  pour Route15 (isolate 0.254): 45,36 47.7,36 47.7,23.8 43.5,19.6 32.2,19.6 28.9,22.9 28.7,23.1 28.7,26.1 28.7,26.4 30.7,26.4 30.7,24.2 32.3,22.6 33.8,22.6 36.6,25.4 37.4,25.4 37.8,25 40.5,25 41,25.5 41,27.3 45,31.3

### Text on the board
bPlace: I/Q input board | 10/2019 | Rev. A | github.com/jankae/Signalgenerator
tNames: -3V3 | GND | +3V3